# Altium schematic sheet klokun.SchDoc: Лабораторна робота №2
size 297 x 209 mm; DrawnBy: Ульчич І. Г.
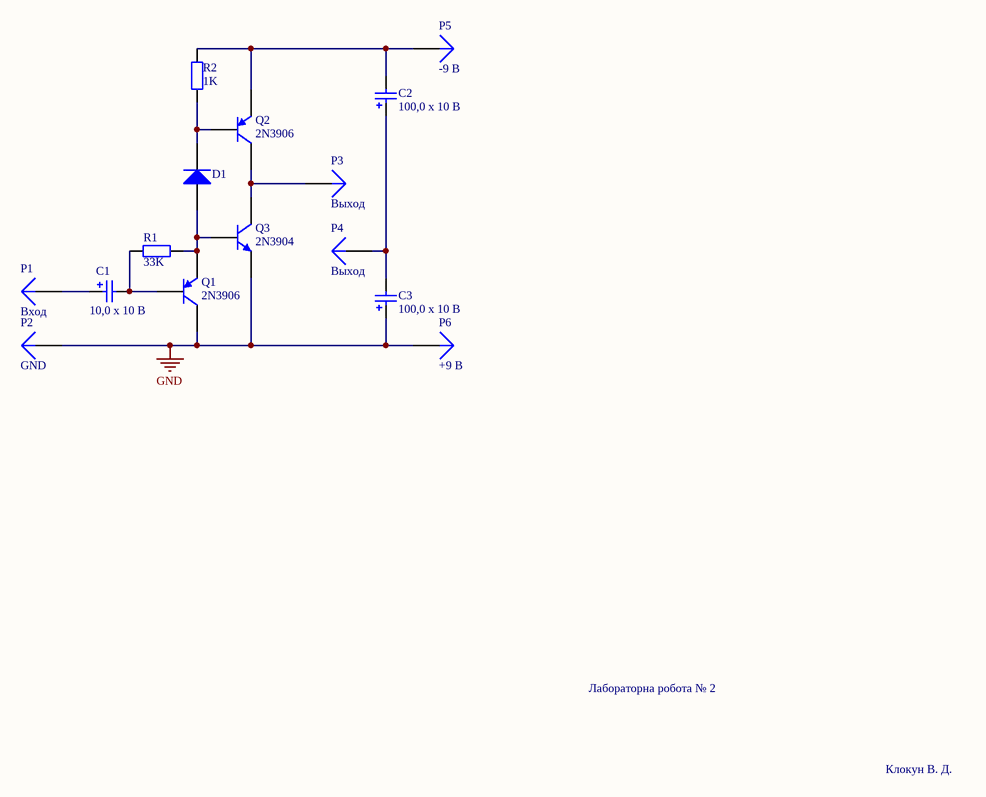
[diagram p0: klokun.SchDoc]

## Parts
C1  value 10,0 x 10 В  [POLAR0.8]  (hidden comment: Cap Pol2)
C2  value 100,0 x 10 В  [POLAR0.8]  (hidden comment: Cap Pol2)
C3  value 100,0 x 10 В  [POLAR0.8]  (hidden comment: Cap Pol2)
D1  Diode 1N4148  [DO-35]  (value not drawn)
P1  Вход  [PIN1]
P2  GND  [PIN1]
P3  Выход  [PIN1]
P4  Выход  [PIN1]
P5  -9 В  [PIN1]
P6  +9 В  [PIN1]
Q1  2N3906  [TO-92A]
Q2  2N3906  [TO-92A]
Q3  2N3904  [TO-92A]
R1  value 33K  [AXIAL-0.4]  (hidden comment: Res2)
R2  value 1K  [AXIAL-0.4]  (hidden comment: Res2)

## Nets
GND: C3.1 P2.1 P6.1 Q1.3(C) Q3.1(E)
NetC1_1: C1.1 P1.1
NetC1_2: C1.2 Q1.2(B) R1.1
NetC2_1: C2.1 C3.2 P4.1
NetC2_2: C2.2 P5.1 Q2.1(E) R2.2
NetD1_1: D1.1(A) Q1.1(E) Q3.2(B) R1.2
NetD1_2: D1.2(K) Q2.2(B) R2.1
NetP3_1: P3.1 Q2.3(C) Q3.3(C)

## Notes on the sheet
- Лабораторна робота № 2
- Клокун В. Д.

## Library data of the parts
C1-C3 = Cap Pol2: Polarized Capacitor (Axial); Published: 8-Jun-2000; LatestRevisionDate: 17-Jul-2002; LatestRevisionNote: Re-released for DXP Platform.; PackageReference: POLAR0.8; Publisher: Altium Limited
D1 = Diode 1N4148: High Conductance Fast Diode; Published: 8-Jun-2000; LatestRevisionDate: 17-Jul-2002; LatestRevisionNote: Re-released for DXP Platform.; DatasheetDocument: 1997; PackageReference: DO-35; Publisher: Altium Limited; Code_JEDEC: DO-204-AH; ComponentLink1Description: Manufacturer Link; ComponentLink1URL: http://www.fairchildsemi.com/; ComponentLink2Description: Datasheet; ComponentLink2URL: http://www.fairchildsemi.com/ds/1N%2F1N4148.pdf
P1-P6 = Plug: LatestRevisionDate: 17-Jul-2002; LatestRevisionNote: Re-released for DXP Platform.; Publisher: Altium Limited
Q1 Q2 = 2N3906: PNP General Purpose Amplifier; Published: 8-Jun-2000; LatestRevisionDate: 15-Jan-2003; LatestRevisionNote: PCB Footprint 'BCY-W3/D4.7' replaced; DatasheetDocument: 1997; PackageDocument: Sep-1998; PackageReference: TO-92A; Publisher: Altium Limited; Code_JEDEC: TO-92A; ComponentLink1Description: Manufacturer Link; ComponentLink1URL: http://www.fairchildsemi.com/; ComponentLink2Description: Datasheet; ComponentLink2URL: http://www.fairchildsemi.com/ds/2N%2F2N3906.pdf
Q3 = 2N3904: NPN General Purpose Amplifier; Published: 8-Jun-2000; LatestRevisionDate: 15-Jan-2003; LatestRevisionNote: PCB Footprint 'BCY-W3/D4.7' replaced; DatasheetDocument: 1997; PackageDocument: Sep-1998; PackageReference: TO-92A; Publisher: Altium Limited; Code_JEDEC: TO-92A; ComponentLink1Description: Manufacturer Link; ComponentLink1URL: http://www.fairchildsemi.com/; ComponentLink2Description: Datasheet; ComponentLink2URL: http://www.fairchildsemi.com/ds/2N%2F2N3904.pdf
R1 R2 = Res2: Resistor; Published: 8-Jun-2000; LatestRevisionDate: 17-Jul-2002; LatestRevisionNote: Re-released for DXP Platform.; PackageReference: AXIAL-0.4; Publisher: Altium Limited